# Altium schematic sheet [02] - BLOCK DIAGRAM.SchDoc
size A3; DocumentNumber: 2; SheetNumber: 2; SheetTotal: 4
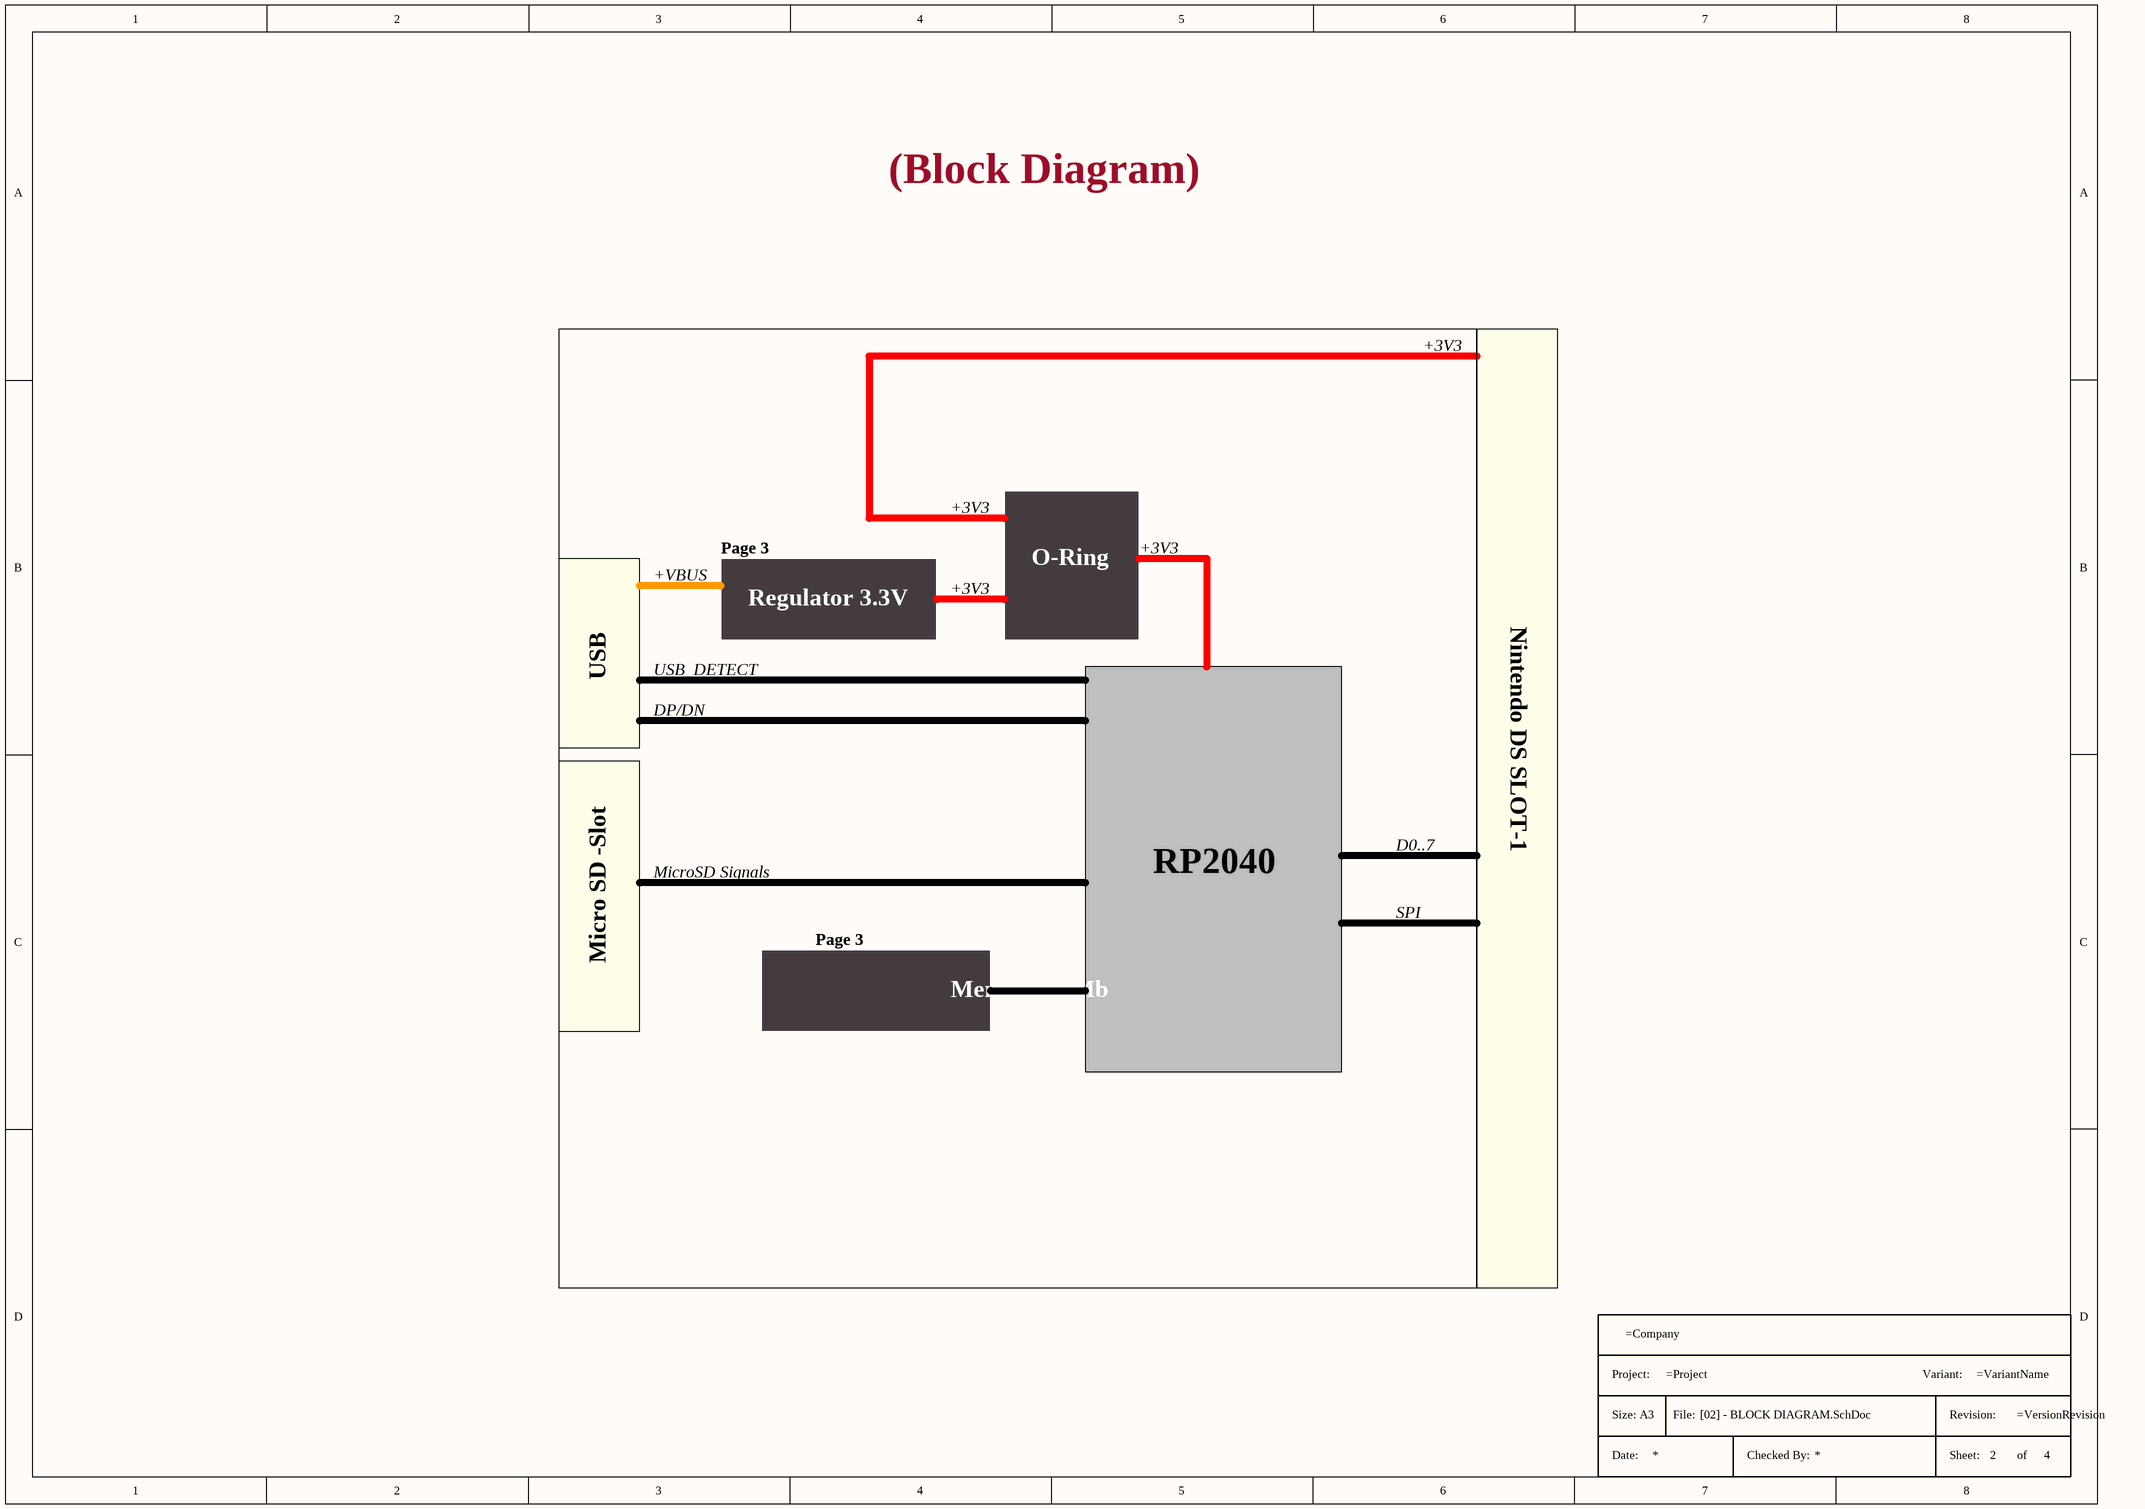
[diagram p0: [02] - BLOCK DIAGRAM.SchDoc]

## Parts
*  Title Block A3  (value not drawn)  (graphical)

## Notes on the sheet
- (Block Diagram)
- +3V3
- +VBUS
- Page 3
- O-Ring
- Regulator 3.3V
- Nintendo DS SLOT-1
- USB
- DP/DN
- USB_DETECT
- D0..7
- MicroSD Signals
- RP2040
- SPI
- Micro SD -Slot
- Memory 16Mb
- (in symbol Title Block A3) Project:; Variant:; Size: A3; File:; Revision:; Date:; Checked By:; Sheet:; of